# Altium schematic sheet Voltage Sense Board.SchDoc
size A3
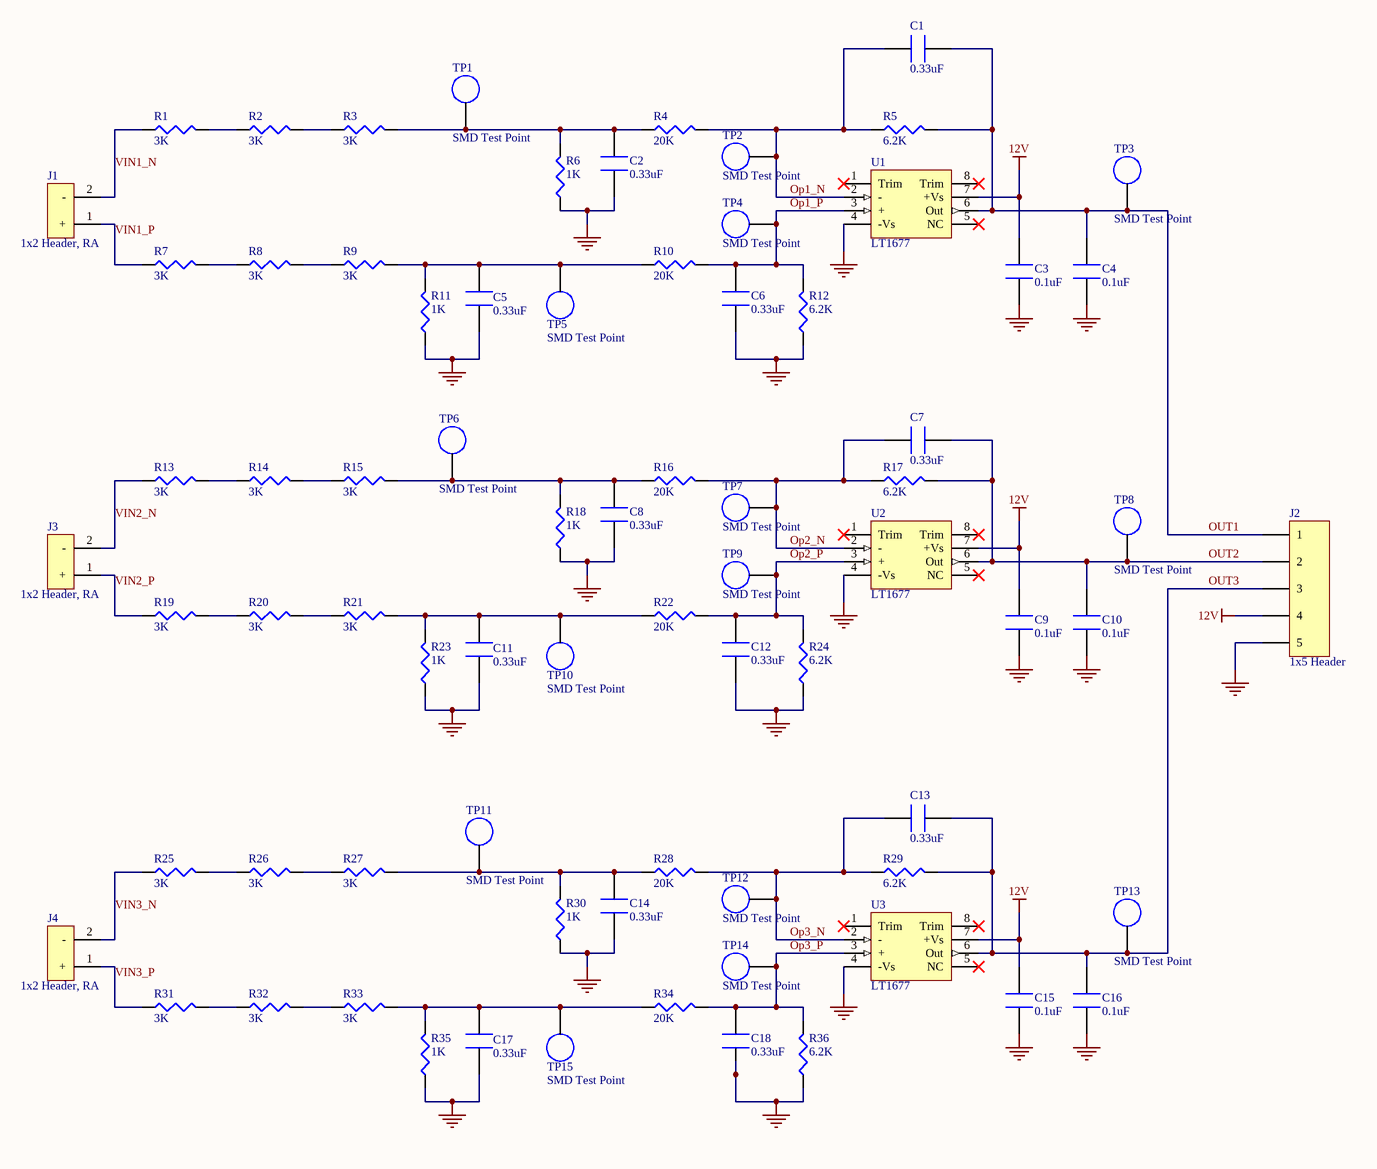
[diagram p0: Voltage Sense Board.SchDoc]

## Parts
C1  0.33uF
C2  0.33uF
C3  0.1uF
C4  0.1uF
C5  0.33uF
C6  0.33uF
C7  0.33uF
C8  0.33uF
C9  0.1uF
C10  0.1uF
C11  0.33uF
C12  0.33uF
C13  0.33uF
C14  0.33uF
C15  0.1uF
C16  0.1uF
C17  0.33uF
C18  0.33uF
J1  1x2 Header, RA
J2  1x5 Header
J3  1x2 Header, RA
J4  1x2 Header, RA
R1  3K
R2  3K
R3  3K
R4  20K
R5  6.2K
R6  1K
R7  3K
R8  3K
R9  3K
R10  20K
R11  1K
R12  6.2K
R13  3K
R14  3K
R15  3K
R16  20K
R17  6.2K
R18  1K
R19  3K
R20  3K
R21  3K
R22  20K
R23  1K
R24  6.2K
R25  3K
R26  3K
R27  3K
R28  20K
R29  6.2K
R30  1K
R31  3K
R32  3K
R33  3K
R34  20K
R35  1K
R36  6.2K
TP1  SMD Test Point
TP2  SMD Test Point
TP3  SMD Test Point
TP4  SMD Test Point
TP5  SMD Test Point
TP6  SMD Test Point
TP7  SMD Test Point
TP8  SMD Test Point
TP9  SMD Test Point
TP10  SMD Test Point
TP11  SMD Test Point
TP12  SMD Test Point
TP13  SMD Test Point
TP14  SMD Test Point
TP15  SMD Test Point
U1  LT1677
U2  LT1677
U3  LT1677

## Nets
12V: C3.2 C9.2 C15.2 J2.4 U1.7(+Vs) U2.7(+Vs) U3.7(+Vs)
GND: C2.1 C3.1 C4.1 C5.1 C6.1 C8.1 C9.1 C10.1 C11.1 C12.1 C14.1 C15.1 C16.1 C17.1 C18.1 J2.5 R6.1 R11.1 R12.1 R18.1 R23.1 R24.1 R30.1 R35.1 R36.1 U1.4(-Vs) U2.4(-Vs) U3.4(-Vs)
Op1_N: C1.1 R4.2 R5.1 TP2.1 U1.2(-)
Op1_P: C6.2 R10.2 R12.2 TP4.1 U1.3(+)
Op2_N: C7.1 R16.2 R17.1 TP7.1 U2.2(-)
Op2_P: C12.2 R22.2 R24.2 TP9.1 U2.3(+)
Op3_N: C13.1 R28.2 R29.1 TP12.1 U3.2(-)
Op3_P: C18.2 R34.2 R36.2 TP14.1 U3.3(+)
OUT1: C1.2 C4.2 J2.1 R5.2 TP3.1 U1.6(Out)
OUT2: C7.2 C10.2 J2.2 R17.2 TP8.1 U2.6(Out)
OUT3: C13.2 C16.2 J2.3 R29.2 TP13.1 U3.6(Out)
VIN1_N: J1.2(-) R1.1
VIN1_P: J1.1(+) R7.1
VIN2_N: J3.2(-) R13.1
VIN2_P: J3.1(+) R19.1
VIN3_N: J4.2(-) R25.1
VIN3_P: J4.1(+) R31.1
NetC2_2: C2.2 R3.2 R4.1 R6.2 TP1.1
NetC5_2: C5.2 R9.2 R10.1 R11.2 TP5.1
NetC8_2: C8.2 R15.2 R16.1 R18.2 TP6.1
NetC11_2: C11.2 R21.2 R22.1 R23.2 TP10.1
NetC14_2: C14.2 R27.2 R28.1 R30.2 TP11.1
NetC17_2: C17.2 R33.2 R34.1 R35.2 TP15.1
NetR1_2: R1.2 R2.1
NetR2_2: R2.2 R3.1
NetR7_2: R7.2 R8.1
NetR8_2: R8.2 R9.1
NetR13_2: R13.2 R14.1
NetR14_2: R14.2 R15.1
NetR19_2: R19.2 R20.1
NetR20_2: R20.2 R21.1
NetR25_2: R25.2 R26.1
NetR26_2: R26.2 R27.1
NetR31_2: R31.2 R32.1
NetR32_2: R32.2 R33.1

Not connected (* = marked no-connect by the designer): U1 1(Trim)* 5(NC)* 8(Trim)*; U2 1(Trim)* 5(NC)* 8(Trim)*; U3 1(Trim)* 5(NC)* 8(Trim)*

## Notes on the sheet
- Title
- Size:
- Date:
- A3
- Number:
- Time:
- Revision:
- Sheet
- of
- File:

## Library data of the parts
C1 C2 C5-C8 C11-C14 C17 C18 = CL21B334KBFVPNE: CAP CER 0.33UF 50V X7R 0805; Manufacturer: Samsung; Capacitance: 330nF; Tolerance: 10%; Supplier 1: Digi-Key; Supplier Part Number 1: 1276-6813-1-ND; Manufacturer Part Number: CL21B334KBFVPNE; Stock 1: 190572; Pricing 1: 1 = 0.22000, 10 = 0.15200, 100 = 0.07690, 500 = 0.05260, 1000 = 0.04653 (USD); RoHS: Yes; Mount: Surface Mount; Case/Package: 0805; Case Code (Metric): 2012; Case Code (Imperial): 0805; Min Operating Temperature: -55°C; Max Operating Temperature: 125°C; Packaging: Tape and Reel; Voltage Rating: 50V; Features: Soft Termination; Length: 0.079inch; Width: 0.049inch; Thickness: 0.053inch; Ratings: AEC-Q200; Category: Capacitors
C3 C4 C9 C10 C15 C16 = CL21B104KBCWPNC: CAP CER 0.1UF 50V X7R 0805; Manufacturer: Samsung; Capacitance: 100nF; Tolerance: 10%; Supplier 1: Digi-Key; Supplier Part Number 1: 1276-6557-1-ND; Manufacturer Part Number: CL21B104KBCWPNC; Stock 1: 6545; Pricing 1: 1 = 0.10000, 10 = 0.06700, 100 = 0.02990, 500 = 0.02138, 1000 = 0.01680 (USD); RoHS: Yes; Mount: Surface Mount; Case/Package: 0805; Case Code (Metric): 2012; Case Code (Imperial): 0805; Min Operating Temperature: -55°C; Max Operating Temperature: 125°C; Packaging: Tape and Reel; Voltage Rating: 50V; Features: Soft Termination; Length: 0.079inch; Width: 0.049inch; Thickness: 0.053inch; Ratings: AEC-Q200; Category: Capacitors
J1 J3 J4 = 43650-0205: HEADER, RIGHT ANGLE, 2WAY; Manufacturer: Molex; Number of Positions: 2; Voltage Rating: 600V; Current Rating: 5A; Gender: Male; Pitch: 3mm; Glow Wire Compliant: Compliant; Supplier 1: Digi-Key; Supplier Part Number 1: WM17581-ND; Manufacturer Part Number: 43650-0205; Stock 1: 2695; Pricing 1: 1 = 1.44000, 10 = 1.30500, 100 = 1.11870, 500 = 0.93222, 3927 = 0.74578, 7854 = 0.70849, 11781 = 0.69251 (USD); RoHS: Yes; Contact Material: Brass; Contact Plating: Gold; Housing Material: Thermoplastic; Number of Rows: 1; Packaging: Tray; Termination: Through Hole; Number of Contacts: 2; Orientation: Right Angle; Package Quantity: 3927; Number of Circuits: 2; Halogen Free: Low Halogen; ComponentLink1URL: http://www.farnell.com/cad/153635.pdf?src-supplier=Element14; ComponentLink1Description: http://www.farnell.com/cad/153635.pdf?src-supplier=Element14; ComponentLink2URL: http://www.molex.com/webdocs/datasheets/pdf/en-us/0436500205_PCB_HEADERS.pdf?src-supplier=Avnet; ComponentLink2Description: http://www.molex.com/webdocs/datasheets/pdf/en-us/0436500205_PCB_HEADERS.pdf?src-supplier=Avnet; ComponentLink3URL: http://www.molex.com/webdocs/datasheets/pdf/en-us/0436500205_PCB_HEADERS.pdf?src-supplier=Avnet+Europe; ComponentLink3Description: http://www.molex.com/webdocs/datasheets/pdf/en-us/0436500205_PCB_HEADERS.pdf?src-supplier=Avnet+Europe; ComponentLink4URL: http://www.mouser.com/ds/2/276/0436500205_PCB_HEADERS-148686.pdf?src-supplier=Mouser; ComponentLink4Description: http://www.mouser.com/ds/2/276/0436500205_PCB_HEADERS-148686.pdf?src-supplier=Mouser; Category: Connectors
J2 = 961105-6404-AR: CONN HEADER VERT SGL 5POS GOLD; Manufacturer: 3M; Current Rating: 2A; Voltage Rating: 1kV; Number of Positions: 5; Gender: Male; Connector Type: Male Pin; Pitch: 2.54mm; Contact Post Length: 3.3mm; Supplier 1: Digi-Key; Supplier Part Number 1: 3M9457-05-ND; Manufacturer Part Number: 961105-6404-AR; Stock 1: 3241; Pricing 1: 1 = 0.45000, 10 = 0.42000, 25 = 0.37800, 50 = 0.33600, 100 = 0.32200, 250 = 0.29400, 500 = 0.28000 (USD); RoHS: Yes; Mount: Through Hole; Contact Plating: Gold; Contact Material: Copper Alloy; Color: Black; Housing Material: Thermoplastic; Min Operating Temperature: -25°C; Max Operating Temperature: 105°C; Number of Rows: 1; Contact Gender: Male; Package Quantity: 3000; Packaging: Bulk; Termination: Through Hole; Number of Contacts: 5; Orientation: Straight; Contact Mating Length: 0.22inch; REACH SVHC: Unknown; ComponentLink1URL: http://multimedia.3m.com/mws/media/548112O/3mtm-pin-strip-header-ts2181.pdf?src-supplier=Digi-Key; ComponentLink1Description: http://multimedia.3m.com/mws/media/548112O/3mtm-pin-strip-header-ts2181.pdf?src-supplier=Digi-Key; ComponentLink2URL: http://www.farnell.com/datasheets/2043883.pdf?src-supplier=Element14; ComponentLink2Description: http://www.farnell.com/datasheets/2043883.pdf?src-supplier=Element14; ComponentLink3URL: https://www.alliedelec.com/m/d/80d174baa5292543a073c8ba004840bb.pdf?src-supplier=Allied+Electronics; ComponentLink3Description: https://www.alliedelec.com/m/d/80d174baa5292543a073c8ba004840bb.pdf?src-supplier=Allied+Electronics; Category: Connectors
R1-R3 R7-R9 R13-R15 R19-R21 R25-R27 R31-R33 = ESR10EZPF3001: RES SMD 3K OHM 1% 0.4W 0805; Manufacturer: Rohm; Resistance: 3kR; Max Power Dissipation: 400mW; Temperature Coefficient: 100ppm/°C; Supplier 1: Digi-Key; Supplier Part Number 1: RHM3.00KAECT-ND; Manufacturer Part Number: ESR10EZPF3001; Stock 1: 1040; Pricing 1: 1 = 0.17000, 10 = 0.14600, 100 = 0.05720, 1000 = 0.02396, 2500 = 0.02196 (USD); RoHS: Yes; Case/Package: 0805; Case Code (Metric): 2012; Case Code (Imperial): 0805; Min Operating Temperature: -55°C; Max Operating Temperature: 155°C; Package Quantity: 1; Tolerance: 1%; Packaging: Tape and Reel; Composition: Thick Film; Number of Terminations: 2; Features: Automotive AEC-Q200; Length: 0.079inch; Height: 0.026inch; Width: 0.049inch; ComponentLink1URL: http://www.rohm.com/web/global/datasheet/ESR01MZPF/esr-e?src-supplier=Digi-Key; ComponentLink1Description: http://www.rohm.com/web/global/datasheet/ESR01MZPF/esr-e?src-supplier=Digi-Key; ComponentLink2URL: https://www.rohm.com/datasheet/ESR01MZPF/esr-e?src-supplier=Digi-Key; ComponentLink2Description: https://www.rohm.com/datasheet/ESR01MZPF/esr-e?src-supplier=Digi-Key; Category: Resistors
R4 R10 R16 R22 R28 R34 = TNPW080520K0BEEA: RES 20K OHM 0.1% 1/5W 0805; Manufacturer: Vishay Dale; Tolerance: 1%; Resistance: 20kR; Power Rating: 125mW; Voltage Rating (DC): 100V; Temperature Coefficient: 25ppm/°C; Supplier 1: Digi-Key; Supplier Part Number 1: TNP20.0KABCT-ND; Manufacturer Part Number: TNPW080520K0BEEA; Stock 1: 23647; Pricing 1: 1 = 0.63000, 10 = 0.52100, 100 = 0.35010, 1000 = 0.20576 (USD); RoHS: Yes; Mount: Surface Mount; Case/Package: 0805; Number of Pins: 2; Case Code (Imperial): 0805; Case Code (Metric): 2012; Contact Plating: Tin; Min Operating Temperature: -55°C; Max Operating Temperature: 125°C; Packaging: Tape and Reel; Package Quantity: 5000; Voltage Rating: 100V; Termination: SMD/SMT; Composition: Thin Film; Military Standard: Not; Length: 2mm; Height: 0.45mm; Width: 1.25mm; Depth: 1.25mm; Radiation Hardening: No; Lead Free: Lead Free; REACH SVHC: Unknown; ComponentLink1URL: https://www.alliedelec.com/m/d/50d2ac1c48d1d3072c857498c4cadcee.pdf?src-supplier=Allied+Electronics; ComponentLink1Description: https://www.alliedelec.com/m/d/50d2ac1c48d1d3072c857498c4cadcee.pdf?src-supplier=Allied+Electronics; ComponentLink2URL: http://www.vishay.com/docs/28758/tnpw_e3.pdf?src-supplier=Avnet; ComponentLink2Description: http://www.vishay.com/docs/28758/tnpw_e3.pdf?src-supplier=Avnet; ComponentLink3URL: http://www.farnell.com/datasheets/2049119.pdf?src-supplier=Element14; ComponentLink3Description: http://www.farnell.com/datasheets/2049119.pdf?src-supplier=Element14; ComponentLink4URL: http://www.vishay.com/docs/28758/tnpw_e3.pdf?src-supplier=Future+Electronics; ComponentLink4Description: http://www.vishay.com/docs/28758/tnpw_e3.pdf?src-supplier=Future+Electronics; ComponentLink5URL: https://www.verical.com/server-webapp/html/getDatasheet?partID=91834&src-supplier=Verical; ComponentLink5Description: https://www.verical.com/server-webapp/html/getDatasheet?partID=91834&src-supplier=Verical; ComponentLink6URL: http://www.farnell.com/datasheets/1912606.pdf?src-supplier=Element14; ComponentLink6Description: http://www.farnell.com/datasheets/1912606.pdf?src-supplier=Element14; Category: Resistors
R5 R12 R17 R24 R29 R36 = ERA6AEB622V: RES SMD 6.2K OHM 0.1% 1/8W 0805; Manufacturer: Panasonic; Resistance: 6.2kR; Power Rating: 125mW; Voltage Rating: 100V; Temperature Coefficient: 25ppm/°C; Supplier 1: Digi-Key; Supplier Part Number 1: P6.2KDACT-ND; Manufacturer Part Number: ERA6AEB622V; Stock 1: 153387; Pricing 1: 1 = 0.36000, 10 = 0.30200, 100 = 0.11820, 1000 = 0.04948, 2500 = 0.04536 (USD); RoHS: Yes; Mount: Surface Mount; Case/Package: 0805; Number of Pins: 2; Case Code (Imperial): 0805; Case Code (Metric): 2012; Contact Plating: Tin; Min Operating Temperature: -55°C; Max Operating Temperature: 155°C; Packaging: Tape and Reel; Tolerance: 0.1%; Package Quantity: 1; Composition: Thin Film; Number of Terminations: 2; Military Standard: Not; Termination: Solder; Max Power Dissipation: 125mW; Voltage Rating (DC): 100V; Features: Automotive AEC-Q200; Length: 2mm; Height: 0.5mm; Width: 1.25mm; Depth: 1.25mm; Radiation Hardening: No; REACH SVHC: No SVHC; Lead Free: Lead Free; ComponentLink1URL: http://www.mouser.com/ds/2/315/AOA0000C237-1100991.pdf?src-supplier=Mouser; ComponentLink1Description: http://www.mouser.com/ds/2/315/AOA0000C237-1100991.pdf?src-supplier=Mouser; ComponentLink2URL: https://www.distrelec.biz/Web/Downloads/_t/ds/ERA_eng_tds.pdf?mime=application%2Fpdf&src-supplier=Distrelec; ComponentLink2Description: https://www.distrelec.biz/Web/Downloads/_t/ds/ERA_eng_tds.pdf?mime=application%2Fpdf&src-supplier=Distrelec; ComponentLink3URL: http://www.farnell.com/datasheets/485442.pdf?src-supplier=Farnell; ComponentLink3Description: http://www.farnell.com/datasheets/485442.pdf?src-supplier=Farnell; ComponentLink4URL: http://www.farnell.com/datasheets/2059650.pdf?src-supplier=Farnell; ComponentLink4Description: http://www.farnell.com/datasheets/2059650.pdf?src-supplier=Farnell; ComponentLink5URL: http://www.farnell.com/datasheets/485442.pdf?src-supplier=Element14; ComponentLink5Description: http://www.farnell.com/datasheets/485442.pdf?src-supplier=Element14; ComponentLink6URL: http://www.farnell.com/datasheets/2059650.pdf?src-supplier=Element14; ComponentLink6Description: http://www.farnell.com/datasheets/2059650.pdf?src-supplier=Element14; ComponentLink7URL: http://industrial.panasonic.com/www-data/pdf/AOA0000/AOA0000CE26.pdf?src-supplier=Avnet; ComponentLink7Description: http://industrial.panasonic.com/www-data/pdf/AOA0000/AOA0000CE26.pdf?src-supplier=Avnet; ComponentLink8URL: http://www.produktinfo.conrad.com/datenblaetter/450000-474999/453275-da-01-en-WIDERSTAND_0805_ERA.pdf?src-supplier=Conrad; ComponentLink8Description: http://www.produktinfo.conrad.com/datenblaetter/450000-474999/453275-da-01-en-WIDERSTAND_0805_ERA.pdf?src-supplier=Conrad; Category: Resistors
R6 R11 R18 R23 R30 R35 = 1-2176092-8: RES SMD 1K OHM 0.1% 1/4W 0805; Manufacturer: TE Connectivity; Resistance: 1kR; Max Power Dissipation: 250mW; Temperature Coefficient: 25ppm/°C; Supplier 1: Digi-Key; Supplier Part Number 1: A110543CT-ND; Manufacturer Part Number: 1-2176092-8; Stock 1: 15357; Pricing 1: 1 = 0.53000, 10 = 0.39200, 100 = 0.22860 (USD); RoHS: Yes; Case/Package: 0805; Case Code (Metric): 2012; Case Code (Imperial): 0805; Min Operating Temperature: -55°C; Max Operating Temperature: 155°C; Package Quantity: 1000; Packaging: Tape and Reel; Tolerance: 0.1%; Composition: Thin Film; Number of Terminations: 2; Length: 0.079inch; Height: 0.026inch; Width: 0.049inch; Lead Free: Lead Free; ComponentLink1URL: http://www.te.com/commerce/DocumentDelivery/DDEController?Action=srchrtrv&DocNm=1773272&DocType=DS&DocLang=English&src-supplier=Digi-Key; ComponentLink1Description: http://www.te.com/commerce/DocumentDelivery/DDEController?Action=srchrtrv&DocNm=1773272&DocType=DS&DocLang=English&src-supplier=Digi-Key; ComponentLink2URL: https://www.te.com/commerce/DocumentDelivery/DDEController?Action=srchrtrv&DocNm=1773272&DocType=DS&DocLang=English&src-supplier=Digi-Key; ComponentLink2Description: https://www.te.com/commerce/DocumentDelivery/DDEController?Action=srchrtrv&DocNm=1773272&DocType=DS&DocLang=English&src-supplier=Digi-Key; Category: Resistors
TP1-TP15 = 5019: Phosphor Bronze Contact Miniature Silver Plated Surface Mount Test Points; Manufacturer: Keystone Electronics; Supplier 1: Digi-Key; Supplier Part Number 1: 36-5019CT-ND; Manufacturer Part Number: 5019; Stock 1: 396064; Pricing 1: 1 = 0.35000, 10 = 0.33100, 25 = 0.28400, 50 = 0.24120, 100 = 0.23180, 250 = 0.20812, 500 = 0.19866 (USD); RoHS: Yes; Mount: PCB,Surface Mount; Number of Pins: 1; Contact Plating: Silver; Material: Bronze; Contact Material: Bronze; Packaging: Tape and Reel; Package Quantity: 1; Termination: SMD/SMT; Height: 0.09inch; REACH SVHC: No SVHC; Lead Free: Lead Free; ComponentLink1URL: http://www.keyelco.com/userAssets/file/M60-2p61.pdf?src-supplier=Digi-Key; ComponentLink1Description: http://www.keyelco.com/userAssets/file/M60-2p61.pdf?src-supplier=Digi-Key; ComponentLink2URL: https://www.alliedelec.com/m/d/7cde97af424e5e26d7fd34350071af05.pdf?src-supplier=Allied+Electronics; ComponentLink2Description: https://www.alliedelec.com/m/d/7cde97af424e5e26d7fd34350071af05.pdf?src-supplier=Allied+Electronics; ComponentLink3URL: http://www.keyelco.com/userAssets/file/M60-2p61.pdf?src-supplier=Future+Electronics; ComponentLink3Description: http://www.keyelco.com/userAssets/file/M60-2p61.pdf?src-supplier=Future+Electronics; Category: Test and Measurement
U1-U3 = LT1677IS8#TRPBF: IC OPAMP GP 7.2MHZ RRO 8SO; Manufacturer: Analog Devices / Linear Technology; Common Mode Rejection Ratio: 60dB; Min Dual Supply Voltage: 1.5V; Max Dual Supply Voltage: 18V; Slew Rate: 2.5V/µs; Max Supply Voltage: 44V; Min Supply Voltage: 2.5V; Number of Circuits: 1; Input Bias Current: 2nA; Input Offset Voltage (Vos): 60uV; Operating Supply Current: 2.75mA; Output Current per Channel: 35mA; Voltage Gain: 133.98dB; Power Supply Rejection Ratio (PSRR): 108dB; Supplier 1: Digi-Key; Supplier Part Number 1: LT1677IS8#TRPBFCT-ND; Manufacturer Part Number: LT1677IS8#TRPBF; Stock 1: 4539; Pricing 1: 1 = 5.74000, 25 = 5.12560 (USD); RoHS: Yes; Case/Package: SOIC; Number of Pins: 8; Min Operating Temperature: -40°C; Max Operating Temperature: 85°C; Package Quantity: 2500; Unity Gain Bandwidth Product: 7.2MHz; Nominal Gain Bandwidth Product: 7.2MHz; Packaging: Tape and Reel; Gain Bandwidth Product: 7.2MHz; Number of Elements: 1; Number of Channels: 1; Lead Free: Lead Free; ComponentLink1URL: http://www.linear.com/docs/2102?src-supplier=Digi-Key; ComponentLink1Description: http://www.linear.com/docs/2102?src-supplier=Digi-Key; ComponentLink2URL: http://datasheet.iiic.cc/linear_technology/LT1677IS8_TRPBF.pdf?src-supplier=IIIC; ComponentLink2Description: http://datasheet.iiic.cc/linear_technology/LT1677IS8_TRPBF.pdf?src-supplier=IIIC; Category: Integrated Circuits (ICs)